# EAGLE design usb2serial-pic14f1454s (EAGLE 7.6.0)
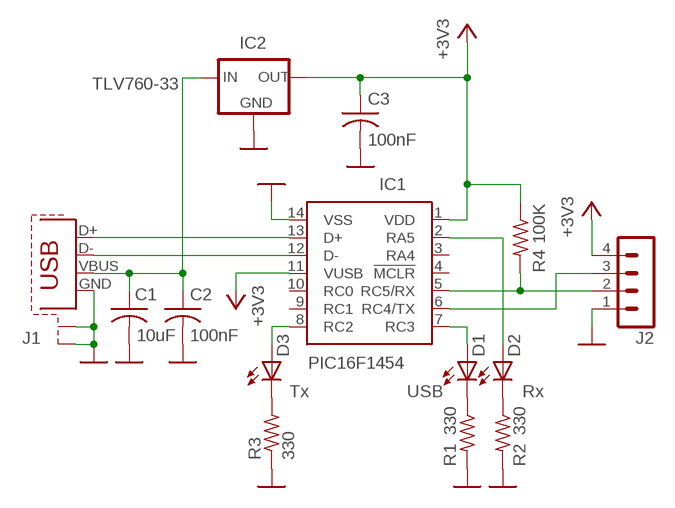
[diagram p0: schematic, sheet 1]

## Parts
C1  10uF  C-USC0805  [C0805]
C2  100nF  C-USC0805  [C0805]
C3  100nF  C-USC0805  [C0805]
D1  Green  LEDCHIPLED_0805  [CHIPLED_0805]
D2  Green  LEDCHIPLED_0805  [CHIPLED_0805]
D3  Green  LEDCHIPLED_0805  [CHIPLED_0805]
IC1  PIC16F1454  PIC16F1454-SOIC  [SOIC-14]
IC2  TLV760-33  TLV760  [SOT23]
J1  USB-SHIELD-A-H1  [USB-A-H1]
J2  J2  MA04-1  [MA04-1]
R1  330  R-US_R0805  [R0805]
R2  330  R-US_R0805  [R0805]
R3  330  R-US_R0805  [R0805]
R4  100K  R-US_R0805  [R0805]

## Nets
+3V3: C3.1 IC1.1(VDD) IC1.11(VUSB) IC2.1(OUT) J2.4 R4.1
GND: C1.2 C2.2 C3.2 IC1.14(VSS) IC2.3(GND) J1.GND J1.GND2(S1) J1.GND3(S2) J2.1 R1.2 R2.2 R3.1
N$1: D3.C R3.2
N$2: D1.C R1.1
N$3: IC1.12(D-) J1.D-
N$4: IC1.13(D+) J1.D+
N$5: D2.C R2.1
N$6: IC1.5(RC5/RX) J2.2 R4.2
N$7: C1.1 C2.1 IC2.2(IN) J1.VBUS
N$9: D1.A IC1.7(RC3)
RA5: D2.A IC1.2(RA5)
RC2: D3.A IC1.8(RC2)
TX1: IC1.6(RC4/TX) J2.3
Unconnected: IC1.3(RA4) IC1.4(!MCLR) IC1.9(RC1) IC1.10(RC0)

## Notes on the sheet
- Tx | USB | Rx

## Library data of the parts
C1-C3 = rcl:C-US: CAPACITOR, American symbol
D1-D3 = led:LED: LED OSRAM: - CHIPLED LG R971, LG N971, LY N971, LG Q971, LY Q971, LO R971, LY R971 LH N974, LH R974 LS Q976, LO Q976, LY Q976 LO Q996 - Hyper CHIPLED LW Q18S LB Q993, LB Q99A, LB R99A - SideLED LS A670, LO A670, LY A670, LG A670, LP A670 LB A673, LV A673, LT A673, LW A673 LH A674 LY A675 LS A676, LA A676, LO A676, LY A676, LW A676 LS A679, LY A679, LG A679 - Hyper Micro SIDELED® LS Y876, LA Y876, LO Y876, LY Y876 LT Y87S - SmartLED LW L88C, LW L88S LB L89C, LB L89S, LG L890 LS L89K, LO L89K, LY L89K LS L896, LA L896, LO L896, LY L896 - TOPLED LS T670, LO T670, LY T670, LG T670, LP T670 LSG T670, LSP T670, LSY T670, LOP T670, LYG T670 LG T671, LOG T671, LSG T671 LB T673, LV T673, LT T673, LW T673 LH T674 LS T676, LA T676, LO T676, LY T676, LB T676, LH T676, LSB T676, LW T676 LB T67C, LV T67C, LT T67C, LS T67K, LO T67K, LY T67K, LW E67C LS E67B, LA E67B, LO E67B, LY E67B, LB E67C, LV E67C, LT E67C LW T67C LS T679, LY T679, LG T679 LS T770, LO T770, LY T770, LG T770, LP T770 LB T773, LV T773, LT T773, LW T773 LH T774 LS E675, LA E675, LY E675, LS T675 LS T776, LA T776, LO T776, LY T776, LB T776 LHGB T686 LT T68C, LB T68C - Hyper Mini TOPLED® LB M676 - Mini TOPLED Santana® LG M470 LS M47K, LO M47K, LY M47K Source: http://www.osram.convergy.de LUXEON: - LUMILED® LXK2-PW12-R00, LXK2-PW12-S00, LXK2-PW14-U00, LXK2-PW14-V00 LXK2-PM12-R00, LXK2-PM12-S00, LXK2-PM14-U00 LXK2-PE12-Q00, LXK2-PE12-R00, LXK2-PE12-S00, LXK2-PE14-T00, LXK2-PE14-U00 LXK2-PB12-K00, LXK2-PB12-L00, LXK2-PB12-M00, LXK2-PB14-N00, LXK2-PB14-P00, LXK2-PB14-Q00 LXK2-PR12-L00, LXK2-PR12-M00, LXK2-PR14-Q00, LXK2-PR14-R00 LXK2-PD12-Q00, LXK2-PD12-R00, LXK2-PD12-S00 LXK2-PH12-R00, LXK2-PH12-S00 LXK2-PL12-P00, LXK2-PL12-Q00, LXK2-PL12-R00 Source: www.luxeon.com KINGBRIGHT: KA-3528ASYC Source: www.kingbright.com
IC1 = obddiag-net:PIC16F1454
IC2 = obddiag-net:TLV760
J1 = obddiag-net:USB-SHIELD
J2 = con-lstb:MA04-1: PIN HEADER; OC_FARNELL: unknown; OC_NEWARK: unknown
R1-R4 = rcl:R-US_: RESISTOR, American symbol

## Board
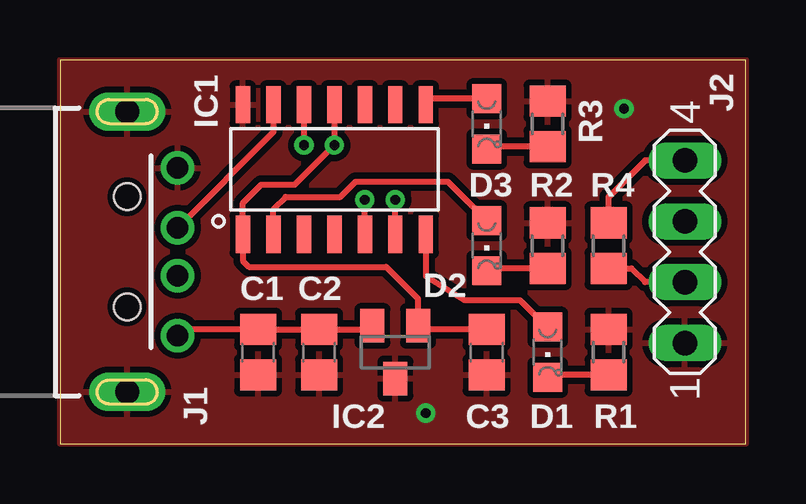
[diagram p1: board, top side]
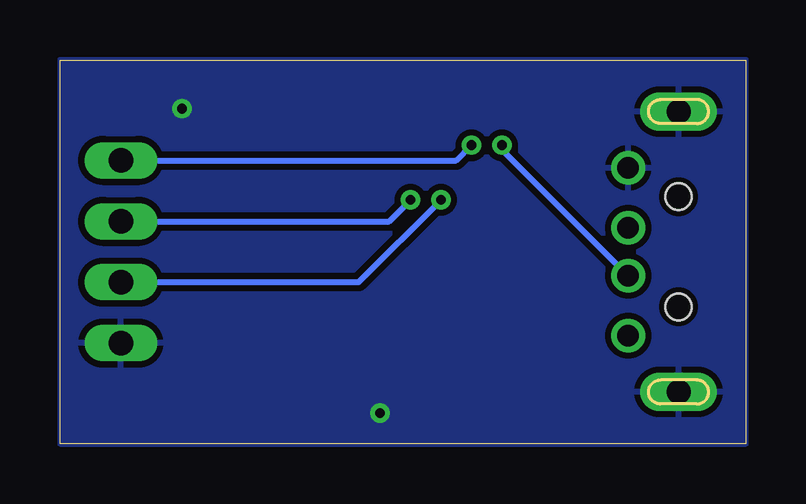
[diagram p2: board, bottom side, seen from below]

Size 28.57 x 16 mm. Coordinates in mm from the lower left corner, seen from the top.
Outline: 0,0 28.57,0 28.57,16 0,16 0,0
Copper layers (1*16): Top 0.035mm / dielectric 1.5mm / Bottom 0.035mm
Design rules "default": minimum track width 10mil, minimum drill 24mil, track to track 8mil, track to pad 8mil, pad to pad 8mil, via to via 8mil, smd to smd 8mil, copper to edge 0mil, drill to drill 8mil, minimum pad ring 10mil, minimum via ring 8mil, stop-mask expansion 4mil, vias tented up to drill 0mil, thermal gap 10mil

### Footprints (pad centres in the part's own frame; a part is rotated, then mirrored left to right if it is on the bottom)
C0805 = smd 1.3 x 1.5: 1 -0.95,0; 2 0.95,0
CHIPLED_0805 = smd 1.2 x 1.2: A 0,-1.05; C 0,1.05
SOIC-14 = smd 0.6 x 1.55: 1 -3.81,-2.7; 2 -2.54,-2.7; 3 -1.27,-2.7; 4 0,-2.7; 5 1.27,-2.7; 6 2.54,-2.7; 7 3.81,-2.7; 8 3.81,2.7; 9 2.54,2.7; 10 1.27,2.7; 11 0,2.7; 12 -1.27,2.7; 13 -2.54,2.7; 14 -3.81,2.7
SOT23 = smd 1 x 1.4: 1 -0.95,-1.1; 2 0.95,-1.1; 3 0,1.1
USB-A-H1 = drill 0.9: D+ 2.1,1; D- 2.1,-1; GND 2.1,3.5; VBUS 2.1,-3.5 | drill 1 pad 1.6 long: GND2 0,-5.85; GND3 0,5.85 | hole 1.1: 0,2.3; 0,-2.3
MA04-1 = drill 1.016 long: 1 -3.81,0; 2 -1.27,0; 3 1.27,0; 4 3.81,0
R0805 = smd 1.3 x 1.5: 1 -0.95,0; 2 0.95,0

### Placement (x,y rotation side)
C1  8.26,3.81 270 top
C2  10.79,3.81 270 top
C3  17.78,3.81 270 top
D1  20.32,3.81 180 top
D2  17.78,8.26 180 top
D3  17.78,13.34 180 top
IC1  11.43,11.43 0 top
IC2  13.97,3.81 180 top
J1  2.8,8 0 top
J2  26.04,8 90 top
R1  22.86,3.81 90 top
R2  20.32,8.26 90 top
R3  20.32,13.34 270 top
R4  22.86,8.26 270 top

### Tracks (layer width: path | path; a pad name or v marks a point on that pad's centre or on a via)
+3V3  (via drill 0.4)
  Top 0.254: C3.1 15.07,4.76 IC2.1 14.92,6.04 13.59,7.37 7.87,7.37 7.62,7.62 IC1.1 7.62,10.03 8.38,10.79 9.78,10.79 v11.43,12.45 IC1.11 | R4.1 22.86,10.29 24.39,11.81 J2.4
  Bottom 0.254: J2.4 12.07,11.81 v11.43,12.45
GND  (via drill 0.4)
  other vias: 23.5,13.97 15.24,1.27
  pour Bottom (isolate 0.254): 0,0 0,16 28.57,16 28.57,0
  pour Top (isolate 0.254): 0,0 0,16 28.57,16 28.57,0
N$1
  Top 0.254: R3.2 17.88,12.38 D3.C
N$2
  Top 0.254: R1.1 20.42,2.86 D1.C
N$3  (via drill 0.4)
  Top 0.254: IC1.12 v10.16,12.45
  Bottom 0.254: v10.16,12.45 10.16,12.26 J1.D-
N$4
  Top 0.254: J1.D+ 8.89,12.99 IC1.13
N$5
  Top 0.254: R2.1 17.88,7.3 D2.C
N$6  (via drill 0.4)
  Top 0.254: IC1.5 v12.7,10.16 | J2.2 24.39,6.73 23.81,7.3 R4.2
  Bottom 0.254: J2.2 16.13,6.73 v12.7,10.16
N$7
  Top 0.254: IC2.2 12.87,4.76 C2.1 C1.1 5.16,4.76 J1.VBUS
N$9
  Top 0.254: IC1.7 15.24,6.99 16.89,5.97 19.18,5.97 20.29,4.86 D1.A
RA5
  Top 0.254: IC1.2 8.89,9.78 9.4,10.29 11.68,10.29 12.32,10.92 16.16,10.92 D2.A
RC2
  Top 0.254: D3.A 15.49,14.38 IC1.8
TX1  (via drill 0.4)
  Top 0.254: IC1.6 v13.97,10.16
  Bottom 0.254: J2.3 14.86,9.27 v13.97,10.16